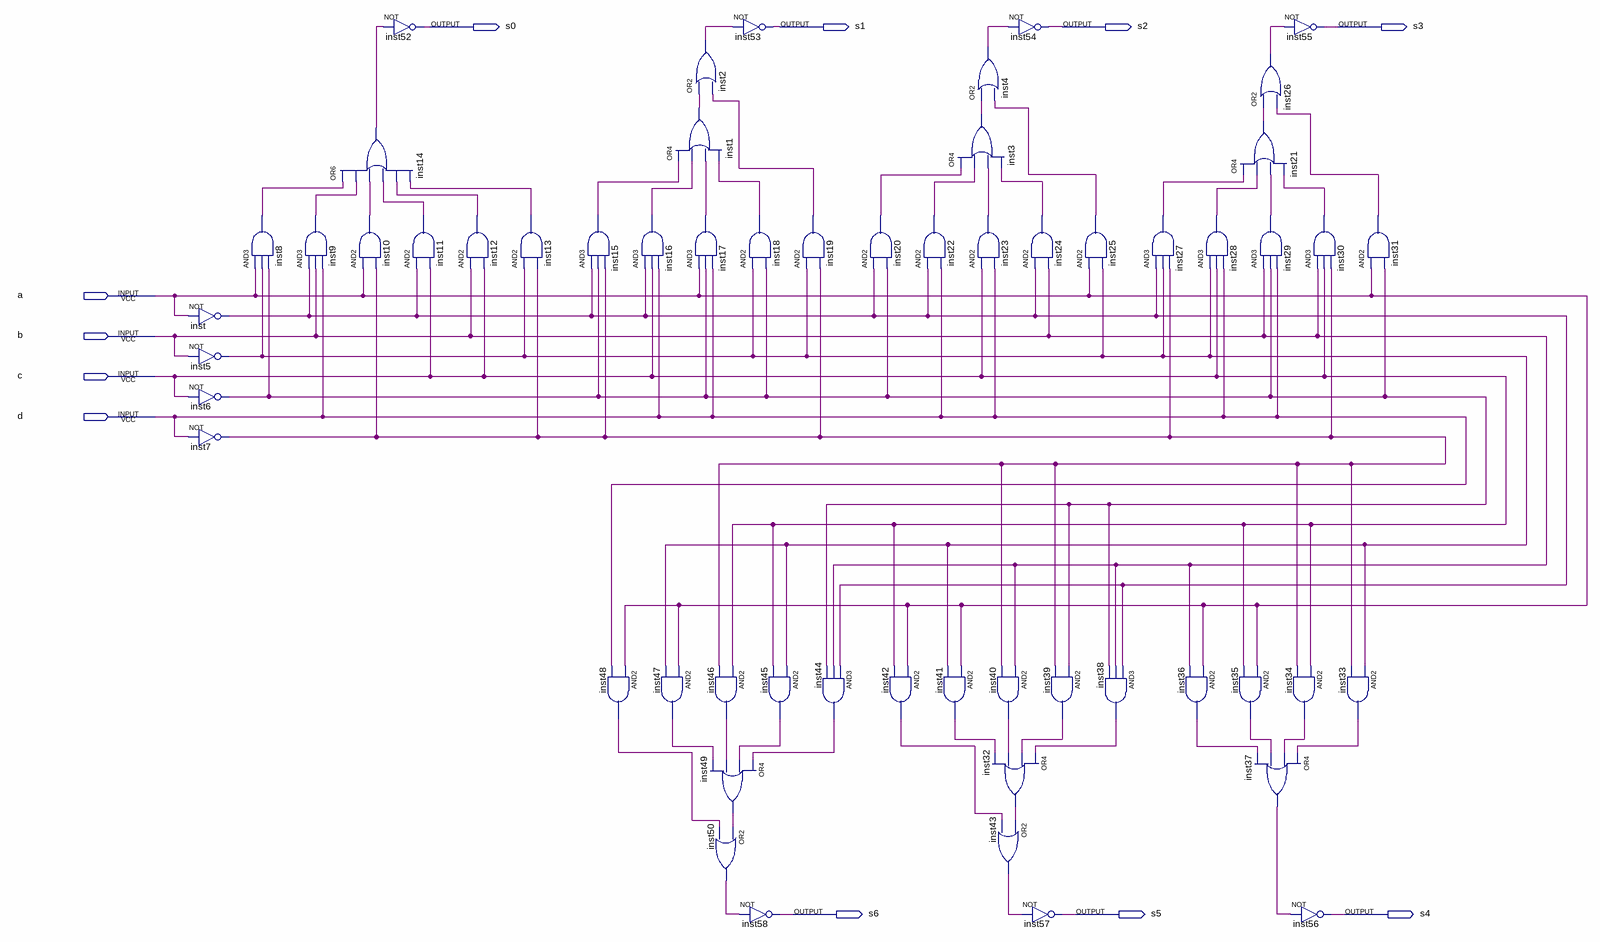
[diagram p0: schematic sheet]
// Quartus schematic aula04.bdf as structural Verilog: 58 symbols, 11 pins
module aula04 (
  input  a,
  input  b,
  input  c,
  input  d,
  output s0,
  output s1,
  output s2,
  output s3,
  output s6,
  output s5,
  output s4
);

  wire inst1_out, inst2_out, inst3_out, inst4_out, inst5_out, inst6_out, inst7_out, inst8_out, inst9_out,
       inst10_out, inst11_out, inst12_out, inst13_out, inst14_out, inst15_out, inst16_out, inst17_out,
       inst18_out, inst19_out, inst20_out, inst21_out, inst22_out, inst23_out, inst24_out, inst25_out,
       inst26_out, inst27_out, inst28_out, inst29_out, inst30_out, inst31_out, inst32_out, inst33_out,
       inst34_out, inst35_out, inst36_out, inst37_out, inst38_out, inst39_out, inst40_out, inst41_out,
       inst42_out, inst43_out, inst44_out, inst45_out, inst46_out, inst47_out, inst48_out, inst49_out,
       inst50_out, inst_out;

  not inst (inst_out, a);
  not inst5 (inst5_out, b);
  not inst6 (inst6_out, c);
  not inst7 (inst7_out, d);
  and inst8 (inst8_out, a, inst5_out, inst6_out);
  or inst14 (inst14_out, inst8_out, inst9_out, inst10_out, inst11_out, inst12_out, inst13_out);
  and inst9 (inst9_out, inst_out, b, d);
  not inst52 (s0, inst14_out);
  and inst10 (inst10_out, a, inst7_out);
  and inst11 (inst11_out, inst_out, c);
  and inst12 (inst12_out, b, c);
  and inst13 (inst13_out, inst5_out, inst7_out);
  and inst15 (inst15_out, inst_out, inst6_out, inst7_out);
  and inst48 (inst48_out, a, d);
  and inst16 (inst16_out, inst_out, c, d);
  and inst47 (inst47_out, a, inst5_out);
  or inst2 (inst2_out, inst1_out, inst19_out);
  or inst1 (inst1_out, inst15_out, inst16_out, inst17_out, inst18_out);
  and inst17 (inst17_out, a, inst6_out, d);
  and inst46 (inst46_out, c, inst7_out);
  or inst49 (inst49_out, inst44_out, inst45_out, inst46_out, inst47_out);
  or inst50 (inst50_out, inst49_out, inst48_out);
  not inst53 (s1, inst2_out);
  and inst18 (inst18_out, inst5_out, inst6_out);
  and inst45 (inst45_out, inst5_out, c);
  not inst58 (s6, inst50_out);
  and inst19 (inst19_out, inst5_out, inst7_out);
  and inst44 (inst44_out, inst_out, b, inst6_out);
  and inst20 (inst20_out, inst_out, inst6_out);
  and inst22 (inst22_out, inst_out, d);
  and inst42 (inst42_out, a, c);
  or inst4 (inst4_out, inst3_out, inst25_out);
  or inst3 (inst3_out, inst20_out, inst22_out, inst23_out, inst24_out);
  and inst23 (inst23_out, c, d);
  and inst41 (inst41_out, a, inst5_out);
  or inst32 (inst32_out, inst38_out, inst39_out, inst40_out, inst41_out);
  not inst54 (s2, inst4_out);
  and inst24 (inst24_out, inst_out, b);
  and inst40 (inst40_out, b, inst7_out);
  or inst43 (inst43_out, inst32_out, inst42_out);
  not inst57 (s5, inst43_out);
  and inst25 (inst25_out, a, inst5_out);
  and inst39 (inst39_out, inst6_out, inst7_out);
  and inst27 (inst27_out, inst_out, inst5_out, inst7_out);
  and inst38 (inst38_out, inst_out, b, inst6_out);
  and inst28 (inst28_out, inst5_out, c, d);
  and inst36 (inst36_out, a, b);
  or inst26 (inst26_out, inst21_out, inst31_out);
  or inst21 (inst21_out, inst27_out, inst28_out, inst29_out, inst30_out);
  and inst29 (inst29_out, b, inst6_out, d);
  and inst35 (inst35_out, a, c);
  or inst37 (inst37_out, inst33_out, inst34_out, inst35_out, inst36_out);
  not inst55 (s3, inst26_out);
  and inst30 (inst30_out, b, c, inst7_out);
  and inst34 (inst34_out, c, inst7_out);
  not inst56 (s4, inst37_out);
  and inst31 (inst31_out, a, inst6_out);
  and inst33 (inst33_out, inst5_out, inst7_out);
endmodule
